# Altium schematic sheet EncoderArm_PhotoReflector.SchDoc
size A4
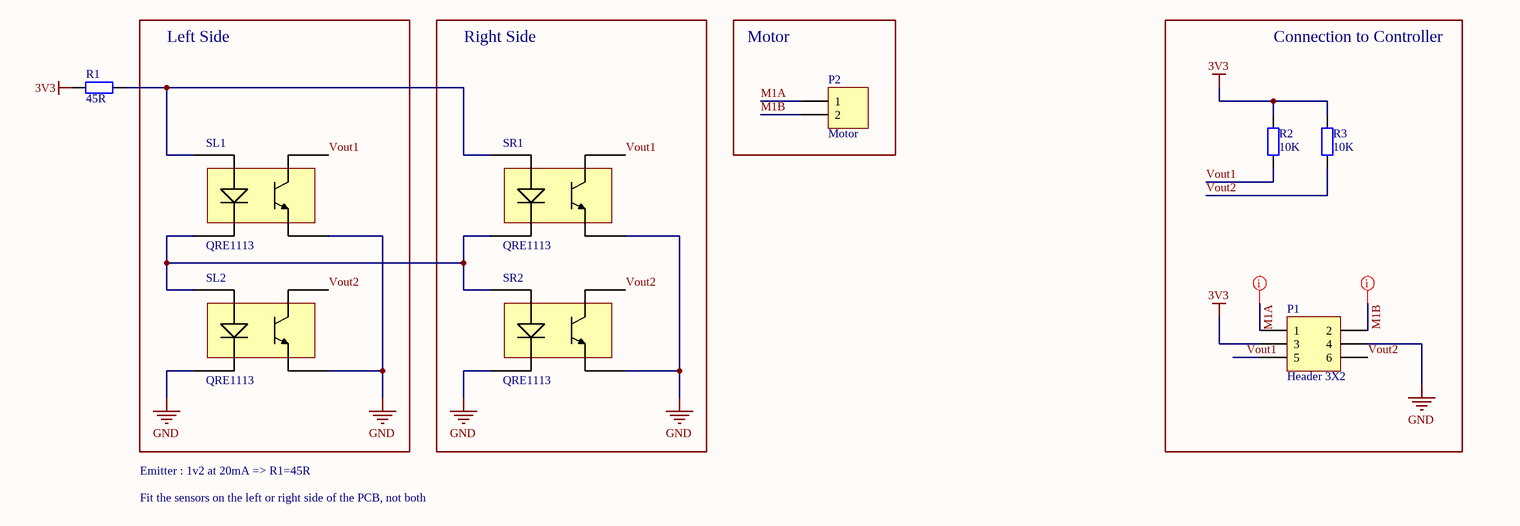
[diagram p0: EncoderArm_PhotoReflector.SchDoc]

## Parts
P1  Header 3X2  [HDR2X3]
P2  Motor  [HDR1X2]
R1  value 45R  [6-0805_M]  (hidden comment: Res2)
R2  value 10K  [6-0805_M]  (hidden comment: Res2)
R3  value 10K  [6-0805_M]  (hidden comment: Res2)
SL1  QRE1113  [QRE1113GR]
SL2  QRE1113  [QRE1113GR]
SR1  QRE1113  [QRE1113GR]
SR2  QRE1113  [QRE1113GR]

## Blocks framed on the sheet
Left Side: SL1 SL2
Right Side: SR1 SR2
Motor: P2
Connection to Controller: P1 R2 R3

## Nets
3V3: P1.3 R1.2 R2.2 R3.2
GND: P1.4 SL1.4(E) SL2.2(K) SL2.4(E) SR1.4(E) SR2.2(K) SR2.4(E)
M1A: P1.1 P2.1
M1B: P1.2 P2.2
Vout1: P1.5 R2.1 SL1.3(C) SR1.3(C)
Vout2: P1.6 R3.1 SL2.3(C) SR2.3(C)
NetR1_1: R1.1 SL1.1(A) SR1.1(A)
NetSL1_2: SL1.2(K) SL2.1(A) SR1.2(K) SR2.1(A)

## Layout directives
net class Power: M1A, M1B

## Notes on the sheet
- Emitter : 1v2 at 20mA => R1=45R
- Fit the sensors on the left or right side of the PCB, not both

## Library data of the parts
P1 = Header 3X2: Header, 3-Pin, Dual row; LatestRevisionDate: 17-Jul-2002; LatestRevisionNote: Re-released for DXP Platform.; Publisher: Altium Limited
P2 = Header 2: Header, 2-Pin; LatestRevisionDate: 17-Jul-2002; LatestRevisionNote: Re-released for DXP Platform.; Publisher: Altium Limited
R1-R3 = Res2: Resistor; Published: 8-Jun-2000; LatestRevisionDate: 17-Jul-2002; LatestRevisionNote: Re-released for DXP Platform.; PackageReference: AXIAL-0.4; Publisher: Altium Limited